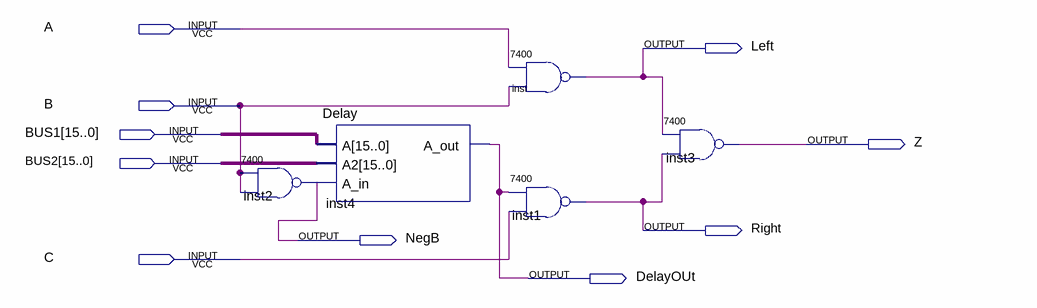
[diagram p0: schematic sheet]
// Quartus schematic Lab1.bdf as structural Verilog: 5 symbols, 10 pins
module Lab1 (
  input  A,
  input  B,
  input  [15:0] BUS1,
  input  [15:0] BUS2,
  input  C,
  output Left,
  output Z,
  output Right,
  output NegB,
  output DelayOUt
);

  \7400  inst2 (.\3 (B), .\2 (B), .\1 (NegB));
  Delay inst4 (.A(BUS1), .A2(BUS2), .A_in(NegB), .A_out(DelayOUt));
  \7400  inst (.\3 (B), .\2 (A), .\1 (Left));
  \7400  inst1 (.\3 (C), .\2 (DelayOUt), .\1 (Right));
  \7400  inst3 (.\3 (Right), .\2 (Left), .\1 (Z));
endmodule
